# EAGLE schematic mainModule (EAGLE 9.6.2)
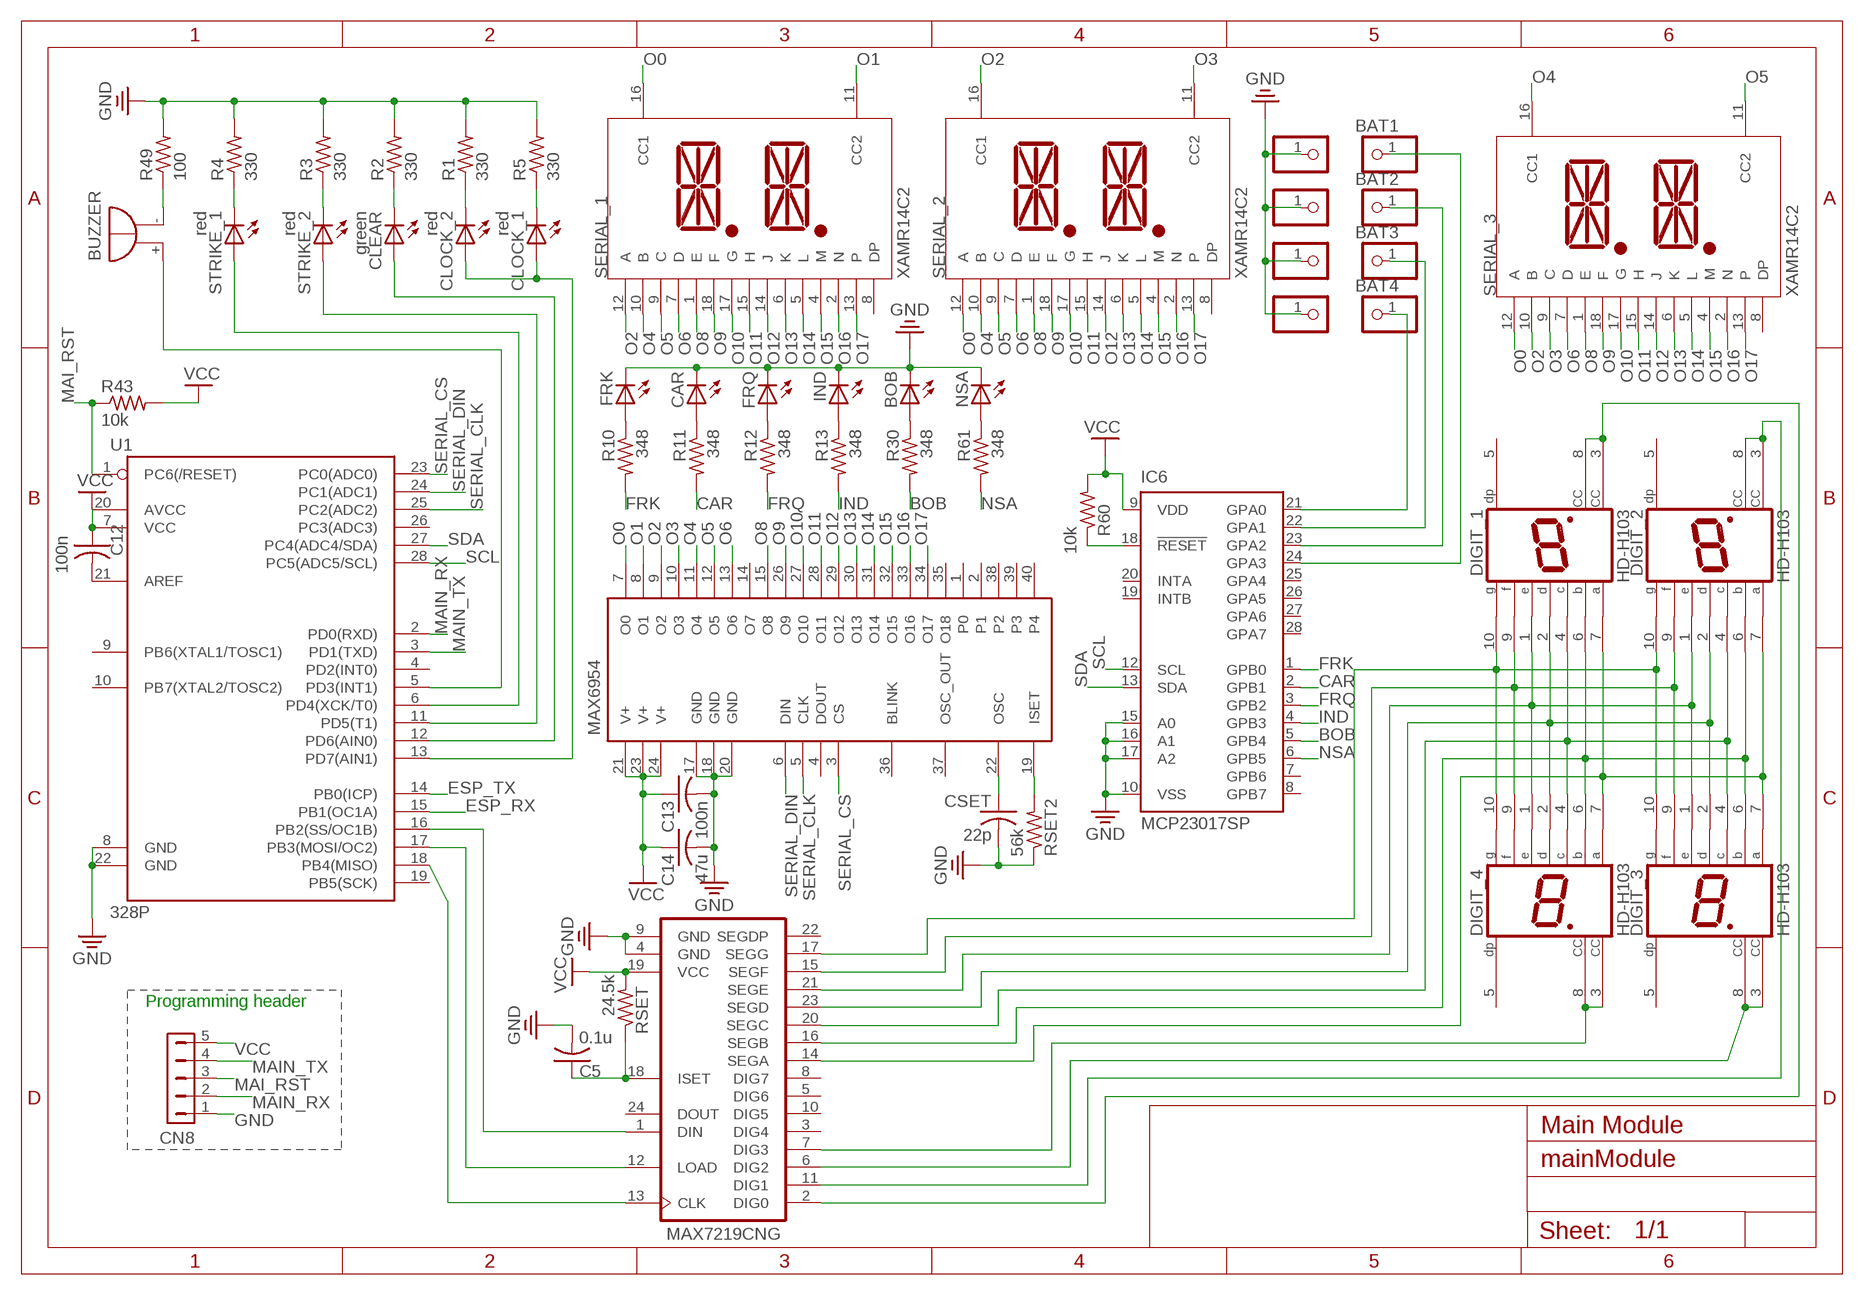
[diagram p0: schematic, sheet 1]

## Parts
BAT1  PINHD-1X1  [1X01]
BAT2  PINHD-1X1  [1X01]
BAT3  PINHD-1X1  [1X01]
BAT4  PINHD-1X1  [1X01]
BOB  LED5MM  [LED5MM]
BUZZER  EB2209A  [EB2209A]
C5  0.1u  C-US025-024X044  [C025-024X044]
C12  100n  C-US025-024X044  [C025-024X044]
C13  100n  C-US025-024X044  [C025-024X044]
C14  47u  C-US025-024X044  [C025-024X044]
CAR  LED5MM  [LED5MM]
CLEAR  green  LED5MM  [LED5MM]
CLOCK_1  red  LED5MM  [LED5MM]
CLOCK_2  red  LED5MM  [LED5MM]
CN8  HDR-1X5-SIP-100  [SIP-100-5V]
CSET  22p  C-US025-024X044  [C025-024X044]
DIGIT_1  HD-H103  [HDSP-M]
DIGIT_2  HD-H103  [HDSP-M]
DIGIT_3  HD-H103  [HDSP-M]
DIGIT_4  HD-H103  [HDSP-M]
FRK  LED5MM  [LED5MM]
FRQ  LED5MM  [LED5MM]
IC1  MAX7219CNG  [DIL24-3]
IC6  MCP23017SP  [DIL28-3]
IND  LED5MM  [LED5MM]
JP17  PINHD-1X1  [1X01]
JP18  PINHD-1X1  [1X01]
JP19  PINHD-1X1  [1X01]
JP20  PINHD-1X1  [1X01]
MAX6954  MAX6954  [MAX6954]
NSA  LED5MM  [LED5MM]
R1  330  R-US_0309/12  [0309/12]
R2  330  R-US_0309/12  [0309/12]
R3  330  R-US_0309/12  [0309/12]
R4  330  R-US_0309/12  [0309/12]
R5  330  R-US_0309/12  [0309/12]
R10  348  R-US_0204/7  [0204/7]
R11  348  R-US_0204/7  [0204/7]
R12  348  R-US_0204/7  [0204/7]
R13  348  R-US_0204/7  [0204/7]
R30  348  R-US_0204/7  [0204/7]
R43  10k  R-US_0309/12  [0309/12]
R49  100  R-US_0309/12  [0309/12]
R60  10k  R-US_0204/7  [0204/7]
R61  348  R-US_0204/7  [0204/7]
RSET  24.5k  R-US_0204/7  [0204/7]
RSET2  56k  R-US_0204/7  [0204/7]
SERIAL_1  XAMR14C2  [XAMR14C2]
SERIAL_2  XAMR14C2  [XAMR14C2]
SERIAL_3  XAMR14C2  [XAMR14C2]
STRIKE_1  red  LED5MM  [LED5MM]
STRIKE_2  red  LED5MM  [LED5MM]
U1  328P  ATMEGA328P_PDIP  [DIP28]

## Nets
BAT1: BAT1.1 IC6.24(GPA3)
BOB: IC6.5(GPB4) R30.2
CAR: IC6.2(GPB1) R11.2
ESP_RX: U1.15(PB1(OC1A))
ESP_TX: U1.14(PB0(ICP))
FRK: IC6.1(GPB0) R10.2
FRQ: IC6.3(GPB2) R12.2
GND: BOB.K(C) C5.2 C13.2 C14.2 CAR.K(C) CN8.1 CSET.2 FRK.K(C) FRQ.K(C) IC1.4(GND) IC1.9(GND) IC6.10(VSS) IC6.15(A0) IC6.16(A1) IC6.17(A2) IND.K(C) JP17.1 JP18.1 JP19.1 JP20.1 MAX6954.17(GND) MAX6954.18(GND) MAX6954.20(GND) NSA.K(C) R1.2 R2.2 R3.2 R4.2 R5.2 R49.2 RSET2.1 U1.8(GND) U1.22(GND)
IND: IC6.4(GPB3) R13.2
MAI_RST: CN8.3 R43.1 U1.1(PC6(/RESET))
MAIN_RX: CN8.2 U1.2(PD0(RXD))
MAIN_TX: CN8.4 U1.3(PD1(TXD))
N$1: DIGIT_1.7(A) DIGIT_2.7(A) DIGIT_3.7(A) DIGIT_4.7(A) IC1.14(SEGA)
N$2: DIGIT_1.6(B) DIGIT_2.6(B) DIGIT_3.6(B) DIGIT_4.6(B) IC1.16(SEGB)
N$3: DIGIT_1.4(C) DIGIT_2.4(C) DIGIT_3.4(C) DIGIT_4.4(C) IC1.20(SEGC)
N$4: DIGIT_1.2(D) DIGIT_2.2(D) DIGIT_3.2(D) DIGIT_4.2(D) IC1.23(SEGD)
N$5: DIGIT_1.1(E) DIGIT_2.1(E) DIGIT_3.1(E) DIGIT_4.1(E) IC1.21(SEGE)
N$6: DIGIT_1.9(F) DIGIT_2.9(F) DIGIT_3.9(F) DIGIT_4.9(F) IC1.15(SEGF)
N$7: DIGIT_1.10(G) DIGIT_2.10(G) DIGIT_3.10(G) DIGIT_4.10(G) IC1.17(SEGG)
N$8: CSET.1 MAX6954.22(OSC)
N$9: MAX6954.19(ISET) RSET2.2
N$10: IC1.12(LOAD) U1.17(PB3(MOSI/OC2))
N$11: IC1.1(DIN) U1.16(PB2(SS/OC1B))
N$12: IC1.13(CLK) U1.18(PB4(MISO))
N$13: DIGIT_2.3(CC) DIGIT_2.8(CC) IC1.11(DIG1)
N$14: DIGIT_1.3(CC) DIGIT_1.8(CC) IC1.2(DIG0)
N$15: BUZZER.- R49.1
N$18: DIGIT_3.3(CC) DIGIT_3.8(CC) IC1.6(DIG2)
N$19: DIGIT_4.3(CC) DIGIT_4.8(CC) IC1.7(DIG3)
N$22: R4.1 STRIKE_1.K(C)
N$23: R3.1 STRIKE_2.K(C)
N$24: CLEAR.K(C) R2.1
N$25: CLOCK_2.K(C) R1.1
N$26: CLOCK_1.K(C) R5.1
N$28: STRIKE_1.A U1.6(PD4(XCK/T0))
N$29: STRIKE_2.A U1.11(PD5(T1))
N$30: CLEAR.A U1.12(PD6(AIN0))
N$31: CLOCK_1.A CLOCK_2.A U1.13(PD7(AIN1))
N$73: C5.1 IC1.18(ISET) RSET.1
N$108: IC6.18(!RESET) R60.1
N$115: BUZZER.+ U1.5(PD3(INT1))
N$127: FRK.A R10.1
N$128: BAT2.1 IC6.23(GPA2)
N$140: C12.2 U1.21(AREF)
N$141: BAT3.1 IC6.22(GPA1)
N$142: BAT4.1 IC6.21(GPA0)
N$143: CAR.A R11.1
N$146: FRQ.A R12.1
N$147: IND.A R13.1
N$148: BOB.A R30.1
N$151: NSA.A R61.1
NSA: IC6.6(GPB5) R61.2
O0: MAX6954.7(O0) SERIAL_1.16(CC1) SERIAL_2.12(A) SERIAL_3.12(A)
O1: MAX6954.8(O1) SERIAL_1.11(CC2)
O2: MAX6954.9(O2) SERIAL_1.12(A) SERIAL_2.16(CC1) SERIAL_3.10(B)
O3: MAX6954.10(O3) SERIAL_2.11(CC2) SERIAL_3.9(C)
O4: MAX6954.11(O4) SERIAL_1.10(B) SERIAL_2.10(B) SERIAL_3.16(CC1)
O5: MAX6954.12(O5) SERIAL_1.9(C) SERIAL_2.9(C) SERIAL_3.11(CC2)
O6: MAX6954.13(O6) SERIAL_1.7(D) SERIAL_2.7(D) SERIAL_3.7(D)
O8: MAX6954.15(O8) SERIAL_1.1(E) SERIAL_2.1(E) SERIAL_3.1(E)
O9: MAX6954.26(O9) SERIAL_1.18(F) SERIAL_2.18(F) SERIAL_3.18(F)
O10: MAX6954.27(O10) SERIAL_1.17(G) SERIAL_2.17(G) SERIAL_3.17(G)
O11: MAX6954.28(O11) SERIAL_1.15(H) SERIAL_2.15(H) SERIAL_3.15(H)
O12: MAX6954.29(O12) SERIAL_1.14(J) SERIAL_2.14(J) SERIAL_3.14(J)
O13: MAX6954.30(O13) SERIAL_1.6(K) SERIAL_2.6(K) SERIAL_3.6(K)
O14: MAX6954.31(O14) SERIAL_1.5(L) SERIAL_2.5(L) SERIAL_3.5(L)
O15: MAX6954.32(O15) SERIAL_1.4(M) SERIAL_2.4(M) SERIAL_3.4(M)
O16: MAX6954.33(O16) SERIAL_1.2(N) SERIAL_2.2(N) SERIAL_3.2(N)
O17: MAX6954.34(O17) SERIAL_1.13(P) SERIAL_2.13(P) SERIAL_3.13(P)
SCL: IC6.12(SCL) U1.28(PC5(ADC5/SCL))
SDA: IC6.13(SDA) U1.27(PC4(ADC4/SDA))
SERIAL_CLK: MAX6954.5(CLK) U1.25(PC2(ADC2))
SERIAL_CS: MAX6954.3(CS) U1.23(PC0(ADC0))
SERIAL_DIN: MAX6954.6(DIN) U1.24(PC1(ADC1))
VCC: C12.1 C13.1 C14.1 CN8.5 IC1.19(VCC) IC6.9(VDD) MAX6954.21(V+) MAX6954.23(V+) MAX6954.24(V+) R43.2 R60.2 RSET.2 U1.7(VCC) U1.20(AVCC)
Unconnected: DIGIT_1.5(DP) DIGIT_2.5(DP) DIGIT_3.5(DP) DIGIT_4.5(DP) IC1.3(DIG4) IC1.5(DIG6) IC1.8(DIG7) IC1.10(DIG5) IC1.22(SEGDP) IC1.24(DOUT) IC6.7(GPB6) IC6.8(GPB7) IC6.19(INTB) IC6.20(INTA) IC6.25(GPA4) IC6.26(GPA5) IC6.27(GPA6) IC6.28(GPA7) MAX6954.1(P0) MAX6954.2(P1) MAX6954.4(DOUT) MAX6954.14(O7) MAX6954.35(O18) MAX6954.36(BLINK) MAX6954.37(OSC_OUT) MAX6954.38(P2) MAX6954.39(P3) MAX6954.40(P4) SERIAL_1.8(DP) SERIAL_2.8(DP) SERIAL_3.8(DP) U1.4(PD2(INT0)) U1.9(PB6(XTAL1/TOSC1)) U1.10(PB7(XTAL2/TOSC2)) U1.19(PB5(SCK)) U1.26(PC3(ADC3))

## Notes on the sheet
- Programming header
- Main Module

## Library data of the parts
BAT1-BAT4 JP17-JP20 = adafruit:PINHD-1X1: Pin header 1x1 for 0.1" spacing With round pins
BOB CAR CLEAR CLOCK_1 CLOCK_2 FRK FRQ IND NSA STRIKE_1 STRIKE_2 = adafruit:LED: LED OSRAM: - CHIPLED LG R971, LG N971, LY N971, LG Q971, LY Q971, LO R971, LY R971 LH N974, LH R974 LS Q976, LO Q976, LY Q976 LO Q996 - Hyper CHIPLED LW Q18S LB Q993, LB Q99A, LB R99A - SideLED LS A670, LO A670, LY A670, LG A670, LP A670 LB A673, LV A673, LT A673, LW A673 LH A674 LY A675 LS A676, LA A676, LO A676, LY A676, LW A676 LS A679, LY A679, LG A679 - Hyper Micro SIDELED® LS Y876, LA Y876, LO Y876, LY Y876 LT Y87S - SmartLED LW L88C, LW L88S LB L89C, LB L89S, LG L890 LS L89K, LO L89K, LY L89K LS L896, LA L896, LO L896, LY L896 - TOPLED LS T670, LO T670, LY T670, LG T670, LP T670 LSG T670, LSP T670, LSY T670, LOP T670, LYG T670 LG T671, LOG T671, LSG T671 LB T673, LV T673, LT T673, LW T673 LH T674 LS T676, LA T676, LO T676, LY T676, LB T676, LH T676, LSB T676, LW T676 LB T67C, LV T67C, LT T67C, LS T67K, LO T67K, LY T67K, LW E67C LS E67B, LA E67B, LO E67B, LY E67B, LB E67C, LV E67C, LT E67C LW T67C LS T679, LY T679, LG T679 LS T770, LO T770, LY T770, LG T770, LP T770 LB T773, LV T773, LT T773, LW T773 LH T774 LS E675, LA E675, LY E675, LS T675 LS T776, LA T776, LO T776, LY T776, LB T776 LHGB T686 LT T68C, LB T68C - Hyper Mini TOPLED® LB M676 - Mini TOPLED Santana® LG M470 LS M47K, LO M47K, LY M47K Source: http://www.osram.convergy.de/
BUZZER = buzzer:EB2209A: BUZZER Source: Buerklin; OC_FARNELL: unknown; OC_NEWARK: unknown
C5 C12-C14 CSET = adafruit:C-US: CAPACITOR, American symbol
CN8 = con-hdrs40:HDR-1X5: HEADER CONNECTOR
DIGIT_1-DIGIT_4 = display-hp:HD-H103: LED DISPLAY 1-character 7 segment, decimal point right; OC_FARNELL: unknown; OC_NEWARK: unknown
IC1 = maxim:MAX7219CNG: LED DISPLAY DRIVER; MF: MAXIM; MPN: MAX7219CNG; OC_FARNELL: 1523914; OC_NEWARK: 34C4018
IC6 = adafruit:MCP23017: http://ww1.microchip.com/downloads/en/DeviceDoc/21952a.pdf Source: http://ww1.microchip.com/downloads/en/DeviceDoc/21952a.pdf
MAX6954 = MAX6954:MAX6954
R1-R5 R43 R49 = adafruit:R-US_: RESISTOR, American symbol
R10-R13 R30 R60 R61 RSET RSET2 = BeagleBone_Black_Wireless:R-US_: RESISTOR, American symbol
SERIAL_1-SERIAL_3 = MAX6954:XAMR14C2
U1 = SparkFun-IC-Microcontroller:ATMEGA328P_PDIP: Atmel 328P Through hole ATMEGA328P uC used in the Arduino 32kb flash, 1k EEPROM, 2k SRAM Datasheet <http://www.sparkfun.com/datasheets/Components/SMD/ATMega328.pdf> SparkFun Products Storefront component: AVR 28 Pin 20MHz 32K 6A/D - ATMega328P <https://www.sparkfun.com/products/9061> (COM-09061) SparkFun Simon Says - Through-Hole Soldering Kit <https://www.sparkfun.com/products/10547> (KIT-10547) SparkFun Learn to Solder - Simon Says <https://www.sparkfun.com/products/13708> (KIT-13708) SparkFun BigTime Watch Kit <https://www.sparkfun.com/products/11734> (KIT-11734) SparkFun ClockIt <https://www.sparkfun.com/products/10930> (KIT-10930) SparkFun Serial Enabled LCD Kit <https://www.sparkfun.com/products/10097> (LCD-10097) SparkFun Simon Tilts - Through Hole Soldering Kit <https://www.sparkfun.com/products/12634> (KIT-12634) SparkFun Frequency Counter Kit <https://www.sparkfun.com/products/10140> (KIT-10140) FabFM Radio Kit <https://www.sparkfun.com/products/11043> (KIT-11043) SparkFun Binary Blaster Kit <https://www.sparkfun.com/products/12037> (KIT-12037) SparkFun Metro-Gnome <https://www.sparkfun.com/products/9236> (KIT-09236) ATmega328 with Arduino Optiboot (Uno) <https://www.sparkfun.com/products/10524> (DEV-10524); PROD_ID: IC-09136